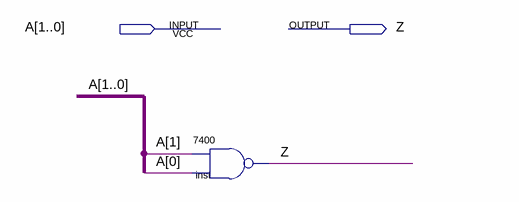
[diagram p0: schematic sheet]
// Quartus schematic nand_2in.bdf as structural Verilog: 1 symbols, 2 pins
module nand_2in (
  input  [1:0] A,
  output Z
);

  \7400  inst (.\3 (A[0]), .\2 (A[1]), .\1 (Z));
endmodule
